# EAGLE design source_eagle (EAGLE 9.6.2)
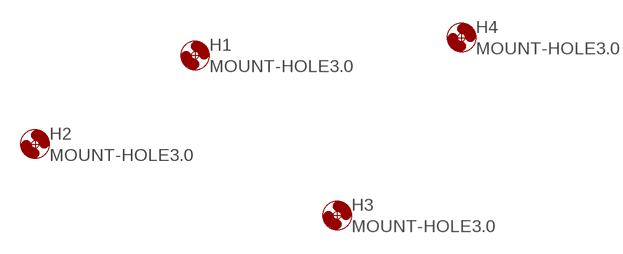
[diagram p0: schematic, sheet 1]

## Parts
H1  MOUNT-HOLE3.0  [3,0]
H2  MOUNT-HOLE3.0  [3,0]
H3  MOUNT-HOLE3.0  [3,0]
H4  MOUNT-HOLE3.0  [3,0]

## Library data of the parts
H1-H4 = holes:MOUNT-HOLE: MOUNTING HOLE with drill center marker

## Board
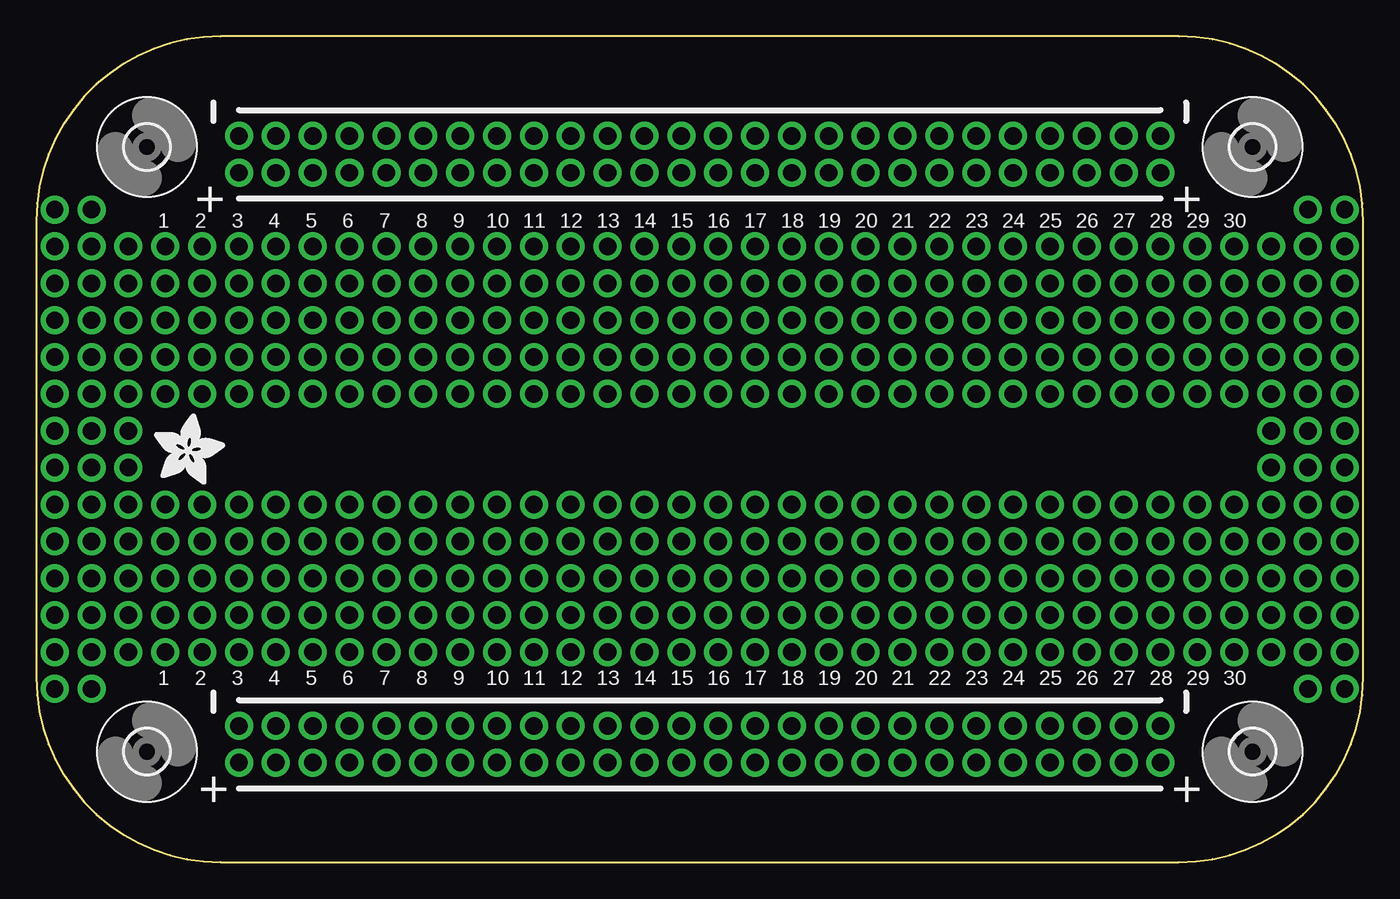
[diagram p1: board, top side]
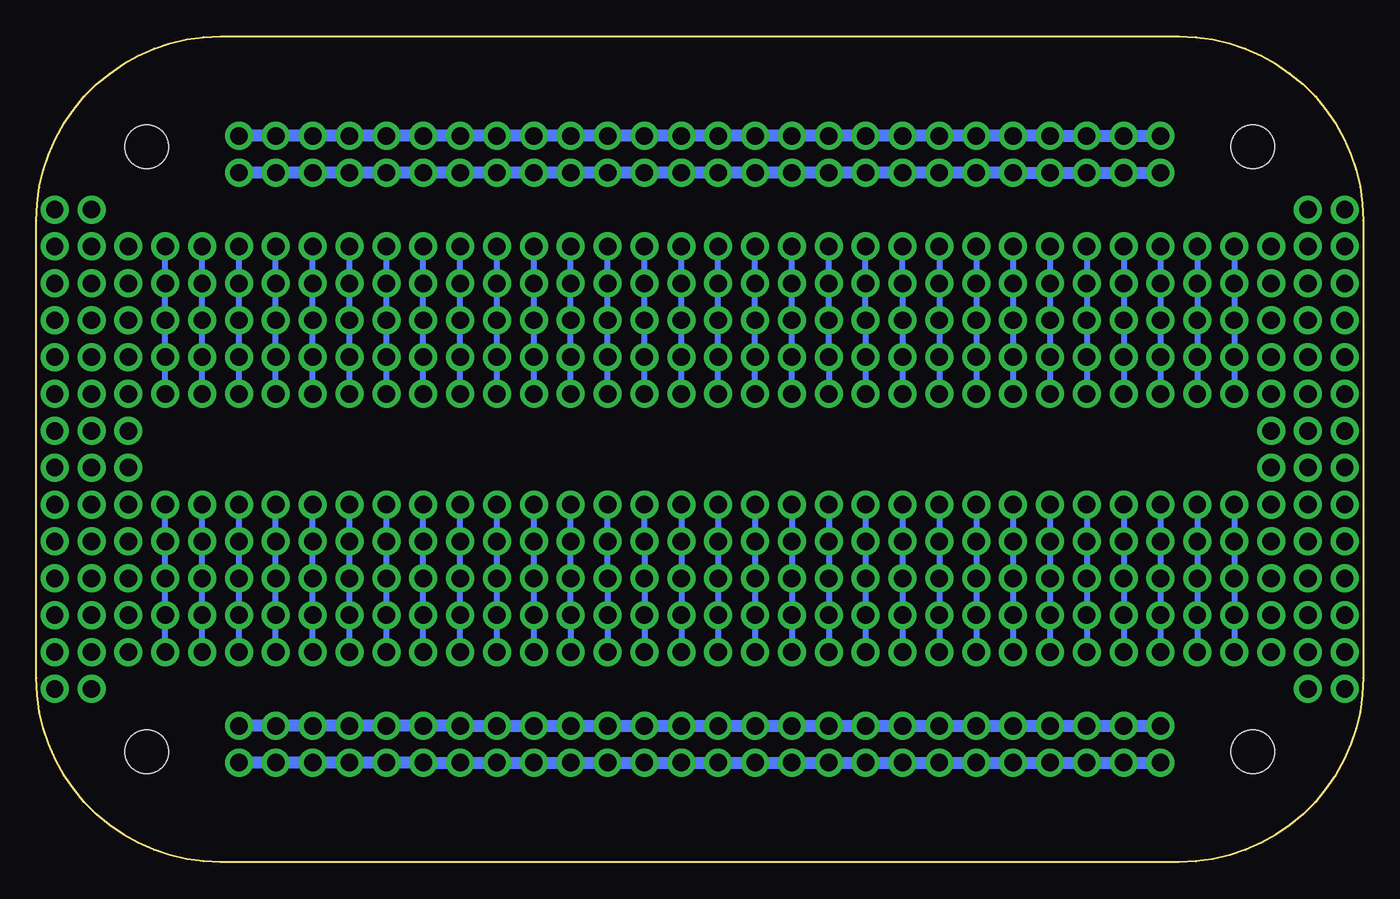
[diagram p2: board, bottom side, seen from below]

Size 91.44 x 56.9 mm. Coordinates in mm from the lower left corner, seen from the top.
Copper layers (1*16): Top 0.035mm / dielectric 1.5mm / Bottom 0.035mm
Design rules "default": minimum track width 10mil, minimum drill 24mil, track to track 8mil, track to pad 8mil, pad to pad 8mil, via to via 8mil, smd to smd 8mil, copper to edge 40mil, drill to drill 8mil, minimum pad ring 10mil, minimum via ring 8mil, stop-mask expansion 4mil, vias tented up to drill 0mil, thermal gap 10mil

### Footprints (pad centres in the part's own frame; a part is rotated, then mirrored left to right if it is on the bottom)
3,0 = hole 3: 0,0

### Placement (x,y rotation side)
H1  7.62,7.62 0 top
H2  83.82,7.62 0 top
H3  7.62,49.28 0 top
H4  83.82,49.28 0 top
U$2  [ALTOIDSTIN-DIM]  45.72,28.45 0 top
U$3  [ADAFRUIT_5MM]  8.13,26.04 0 top

### Tracks (layer width: path | path; a pad name or v marks a point on that pad's centre or on a via)
N$1  (via drill 1.2 pad 1.93)
  Bottom 0.406: v8.89,24.64 v8.89,22.1 v8.89,19.56 v8.89,17.02 v8.89,14.48
N$2  (via drill 1.2 pad 1.93)
  Bottom 0.406: v11.43,14.48 v11.43,17.02 v11.43,19.56 v11.43,22.1 v11.43,24.64
N$3  (via drill 1.2 pad 1.93)
  Bottom 0.406: v13.97,24.64 v13.97,22.1 v13.97,19.56 v13.97,17.02 v13.97,14.48
N$4  (via drill 1.2 pad 1.93)
  Bottom 0.406: v16.51,14.48 v16.51,17.02 v16.51,19.56 v16.51,22.1 v16.51,24.64
N$5  (via drill 1.2 pad 1.93)
  Bottom 0.406: v19.05,24.64 v19.05,22.1 v19.05,19.56 v19.05,17.02 v19.05,14.48
N$6  (via drill 1.2 pad 1.93)
  Bottom 0.406: v21.59,14.48 v21.59,17.02 v21.59,19.56 v21.59,22.1 v21.59,24.64
N$7  (via drill 1.2 pad 1.93)
  Bottom 0.406: v26.67,14.48 v26.67,17.02 v26.67,19.56 v26.67,22.1 v26.67,24.64
N$8  (via drill 1.2 pad 1.93)
  Bottom 0.406: v24.13,24.64 v24.13,22.1 v24.13,19.56 v24.13,17.02 v24.13,14.48
N$9  (via drill 1.2 pad 1.93)
  Bottom 0.406: v29.21,24.64 v29.21,22.1 v29.21,19.56 v29.21,17.02 v29.21,14.48
N$10  (via drill 1.2 pad 1.93)
  Bottom 0.406: v31.75,24.64 v31.75,22.1 v31.75,19.56 v31.75,17.02 v31.75,14.48
N$11  (via drill 1.2 pad 1.93)
  Bottom 0.406: v34.29,24.64 v34.29,22.1 v34.29,19.56 v34.29,17.02 v34.29,14.48
N$12  (via drill 1.2 pad 1.93)
  Bottom 0.406: v36.83,14.48 v36.83,17.02 v36.83,19.56 v36.83,22.1 v36.83,24.64
N$13  (via drill 1.2 pad 1.93)
  Bottom 0.406: v39.37,24.64 v39.37,22.1 v39.37,19.56 v39.37,17.02 v39.37,14.48
N$14  (via drill 1.2 pad 1.93)
  Bottom 0.406: v41.91,14.48 v41.91,17.02 v41.91,19.56 v41.91,22.1 v41.91,24.64
N$15  (via drill 1.2 pad 1.93)
  Bottom 0.406: v44.45,14.48 v44.45,17.02 v44.45,19.56 | v44.45,22.1 v44.45,19.56 | v44.45,24.64 v44.45,22.1 | v44.45,22.1 v44.45,19.56
N$16  (via drill 1.2 pad 1.93)
  Bottom 0.406: v46.99,24.64 v46.99,22.1 v46.99,19.56 v46.99,17.02 v46.99,14.48
N$17  (via drill 1.2 pad 1.93)
  Bottom 0.406: v52.07,24.64 v52.07,22.1 v52.07,19.56 v52.07,17.02 v52.07,14.48
N$18  (via drill 1.2 pad 1.93)
  Bottom 0.406: v49.53,14.48 v49.53,17.02 v49.53,19.56 v49.53,22.1 v49.53,24.64
N$19  (via drill 1.2 pad 1.93)
  Bottom 0.406: v54.61,24.64 v54.61,22.1 v54.61,19.56 v54.61,17.02 v54.61,14.48
N$20  (via drill 1.2 pad 1.93)
  Bottom 0.406: v57.15,14.48 v57.15,17.02 v57.15,19.56 v57.15,22.1 v57.15,24.64
N$21  (via drill 1.2 pad 1.93)
  Bottom 0.406: v62.23,14.48 v62.23,17.02 v62.23,19.56 v62.23,22.1 v62.23,24.64
N$22  (via drill 1.2 pad 1.93)
  Bottom 0.406: v59.69,24.64 v59.69,22.1 v59.69,19.56 v59.69,17.02 v59.69,14.48
N$23  (via drill 1.2 pad 1.93)
  Bottom 0.406: v64.77,24.64 v64.77,22.1 v64.77,19.56 v64.77,17.02 v64.77,14.48
N$24  (via drill 1.2 pad 1.93)
  Bottom 0.406: v67.31,14.48 v67.31,17.02 v67.31,19.56 v67.31,22.1 v67.31,24.64
N$25  (via drill 1.2 pad 1.93)
  Bottom 0.406: v69.85,24.64 v69.85,22.1 v69.85,19.56 v69.85,17.02 v69.85,14.48
N$26  (via drill 1.2 pad 1.93)
  Bottom 0.406: v72.39,14.48 v72.39,17.02 v72.39,19.56 v72.39,22.1 v72.39,24.64
N$27  (via drill 1.2 pad 1.93)
  Bottom 0.406: v77.47,24.64 v77.47,22.1 v77.47,19.56 v77.47,17.02 v77.47,14.48
N$28  (via drill 1.2 pad 1.93)
  Bottom 0.406: v74.93,14.48 v74.93,17.02 v74.93,19.56 v74.93,22.1 v74.93,24.64
N$29  (via drill 1.2 pad 1.93)
  Bottom 0.406: v80.01,24.64 v80.01,22.1 v80.01,19.56 v80.01,17.02 v80.01,14.48
N$30  (via drill 1.2 pad 1.93)
  Bottom 0.406: v82.55,14.48 v82.55,17.02 v82.55,19.56 v82.55,22.1 v82.55,24.64
N$31  (via drill 1.2 pad 1.93)
  Bottom 0.813: v13.97,9.4 v16.51,9.4 v19.05,9.4 v21.59,9.4 v24.13,9.4 v26.67,9.4 v29.21,9.4 v31.75,9.4 v34.29,9.4 v36.83,9.4 v39.37,9.4 v41.91,9.4 v44.45,9.4 v46.99,9.4 v49.53,9.4 v52.07,9.4 v54.61,9.4 | v74.93,9.4 v77.47,9.4 | v72.39,9.4 v74.93,9.4 | v72.39,9.4 v74.93,9.4 | v57.15,9.4 v54.61,9.4 | v57.15,9.4 v54.61,9.4 | v57.15,9.4 v59.69,9.4 v62.23,9.4 v64.77,9.4 v67.31,9.4 v69.85,9.4 v72.39,9.4
N$32  (via drill 1.2 pad 1.93)
  Bottom 0.813: v13.97,6.86 v16.51,6.86 v19.05,6.86 v21.59,6.86 v24.13,6.86 v26.67,6.86 v29.21,6.86 v31.75,6.86 v34.29,6.86 v36.83,6.86 v39.37,6.86 v41.91,6.86 v44.45,6.86 v46.99,6.86 v49.53,6.86 v52.07,6.86 v54.61,6.86 | v57.15,6.86 v54.61,6.86 | v57.15,6.86 v54.61,6.86 | v57.15,6.86 v59.69,6.86 v62.23,6.86 v64.77,6.86 v67.31,6.86 v69.85,6.86 v72.39,6.86 | v74.93,6.86 v77.47,6.86 | v72.39,6.86 v74.93,6.86 | v72.39,6.86 v74.93,6.86
N$33  (via drill 1.2 pad 1.93)
  Bottom 0.406: v82.55,32.26 v82.55,34.8 v82.55,37.34 v82.55,39.88 v82.55,42.42
N$34  (via drill 1.2 pad 1.93)
  Bottom 0.406: v80.01,42.42 v80.01,39.88 v80.01,37.34 v80.01,34.8 v80.01,32.26
N$35  (via drill 1.2 pad 1.93)
  Bottom 0.406: v77.47,32.26 v77.47,34.8 v77.47,37.34 v77.47,39.88 v77.47,42.42
N$36  (via drill 1.2 pad 1.93)
  Bottom 0.406: v74.93,42.42 v74.93,39.88 v74.93,37.34 v74.93,34.8 v74.93,32.26
N$37  (via drill 1.2 pad 1.93)
  Bottom 0.406: v72.39,32.26 v72.39,34.8 v72.39,37.34 v72.39,39.88 v72.39,42.42
N$38  (via drill 1.2 pad 1.93)
  Bottom 0.406: v69.85,42.42 v69.85,39.88 v69.85,37.34 v69.85,34.8 v69.85,32.26
N$39  (via drill 1.2 pad 1.93)
  Bottom 0.406: v64.77,42.42 v64.77,39.88 v64.77,37.34 v64.77,34.8 v64.77,32.26
N$40  (via drill 1.2 pad 1.93)
  Bottom 0.406: v67.31,32.26 v67.31,34.8 v67.31,37.34 v67.31,39.88 v67.31,42.42
N$41  (via drill 1.2 pad 1.93)
  Bottom 0.406: v62.23,32.26 v62.23,34.8 v62.23,37.34 v62.23,39.88 v62.23,42.42
N$42  (via drill 1.2 pad 1.93)
  Bottom 0.406: v59.69,32.26 v59.69,34.8 v59.69,37.34 v59.69,39.88 v59.69,42.42
N$43  (via drill 1.2 pad 1.93)
  Bottom 0.406: v57.15,32.26 v57.15,34.8 v57.15,37.34 v57.15,39.88 v57.15,42.42
N$44  (via drill 1.2 pad 1.93)
  Bottom 0.406: v54.61,42.42 v54.61,39.88 v54.61,37.34 v54.61,34.8 v54.61,32.26
N$45  (via drill 1.2 pad 1.93)
  Bottom 0.406: v52.07,32.26 v52.07,34.8 v52.07,37.34 v52.07,39.88 v52.07,42.42
N$46  (via drill 1.2 pad 1.93)
  Bottom 0.406: v49.53,42.42 v49.53,39.88 v49.53,37.34 v49.53,34.8 v49.53,32.26
N$47  (via drill 1.2 pad 1.93)
  Bottom 0.406: v46.99,42.42 v46.99,39.88 v46.99,37.34 | v46.99,34.8 v46.99,37.34 | v46.99,32.26 v46.99,34.8 | v46.99,34.8 v46.99,37.34
N$48  (via drill 1.2 pad 1.93)
  Bottom 0.406: v44.45,32.26 v44.45,34.8 v44.45,37.34 v44.45,39.88 v44.45,42.42
N$49  (via drill 1.2 pad 1.93)
  Bottom 0.406: v39.37,32.26 v39.37,34.8 v39.37,37.34 v39.37,39.88 v39.37,42.42
N$50  (via drill 1.2 pad 1.93)
  Bottom 0.406: v41.91,42.42 v41.91,39.88 v41.91,37.34 v41.91,34.8 v41.91,32.26
N$51  (via drill 1.2 pad 1.93)
  Bottom 0.406: v36.83,32.26 v36.83,34.8 v36.83,37.34 v36.83,39.88 v36.83,42.42
N$52  (via drill 1.2 pad 1.93)
  Bottom 0.406: v34.29,42.42 v34.29,39.88 v34.29,37.34 v34.29,34.8 v34.29,32.26
N$53  (via drill 1.2 pad 1.93)
  Bottom 0.406: v29.21,42.42 v29.21,39.88 v29.21,37.34 v29.21,34.8 v29.21,32.26
N$54  (via drill 1.2 pad 1.93)
  Bottom 0.406: v31.75,32.26 v31.75,34.8 v31.75,37.34 v31.75,39.88 v31.75,42.42
N$55  (via drill 1.2 pad 1.93)
  Bottom 0.406: v26.67,32.26 v26.67,34.8 v26.67,37.34 v26.67,39.88 v26.67,42.42
N$56  (via drill 1.2 pad 1.93)
  Bottom 0.406: v24.13,42.42 v24.13,39.88 v24.13,37.34 v24.13,34.8 v24.13,32.26
N$57  (via drill 1.2 pad 1.93)
  Bottom 0.406: v21.59,32.26 v21.59,34.8 v21.59,37.34 v21.59,39.88 v21.59,42.42
N$58  (via drill 1.2 pad 1.93)
  Bottom 0.406: v19.05,42.42 v19.05,39.88 v19.05,37.34 v19.05,34.8 v19.05,32.26
N$59  (via drill 1.2 pad 1.93)
  Bottom 0.406: v13.97,32.26 v13.97,34.8 v13.97,37.34 v13.97,39.88 v13.97,42.42
N$60  (via drill 1.2 pad 1.93)
  Bottom 0.406: v16.51,42.42 v16.51,39.88 v16.51,37.34 v16.51,34.8 v16.51,32.26
N$61  (via drill 1.2 pad 1.93)
  Bottom 0.406: v11.43,32.26 v11.43,34.8 v11.43,37.34 v11.43,39.88 v11.43,42.42
N$62  (via drill 1.2 pad 1.93)
  Bottom 0.406: v8.89,42.42 v8.89,39.88 v8.89,37.34 v8.89,34.8 v8.89,32.26
N$63  (via drill 1.2 pad 1.93)
  Bottom 0.813: v77.47,47.5 v74.93,47.5 v72.39,47.5 v69.85,47.5 v67.31,47.5 v64.77,47.5 v62.23,47.5 v59.69,47.5 v57.15,47.5 v54.61,47.5 v52.07,47.5 v49.53,47.5 v46.99,47.5 v44.45,47.5 v41.91,47.5 v39.37,47.5 v36.83,47.5 | v16.51,47.5 v13.97,47.5 | v19.05,47.5 v16.51,47.5 | v19.05,47.5 v16.51,47.5 | v34.29,47.5 v36.83,47.5 | v34.29,47.5 v36.83,47.5 | v34.29,47.5 v31.75,47.5 v29.21,47.5 v26.67,47.5 v24.13,47.5 v21.59,47.5 v19.05,47.5
N$64  (via drill 1.2 pad 1.93)
  Bottom 0.813: v77.47,50.04 v74.93,50.04 v72.39,50.04 v69.85,50.04 v67.31,50.04 v64.77,50.04 v62.23,50.04 v59.69,50.04 v57.15,50.04 v54.61,50.04 v52.07,50.04 v49.53,50.04 v46.99,50.04 v44.45,50.04 v41.91,50.04 v39.37,50.04 v36.83,50.04 | v34.29,50.04 v36.83,50.04 | v34.29,50.04 v36.83,50.04 | v34.29,50.04 v31.75,50.04 v29.21,50.04 v26.67,50.04 v24.13,50.04 v21.59,50.04 v19.05,50.04 | v16.51,50.04 v13.97,50.04 | v19.05,50.04 v16.51,50.04 | v19.05,50.04 v16.51,50.04
N$65  (via drill 1.2 pad 1.93)
  other vias: 6.35,42.42
N$66  (via drill 1.2 pad 1.93)
  other vias: 6.35,39.88
N$67  (via drill 1.2 pad 1.93)
  other vias: 6.35,37.34
N$68  (via drill 1.2 pad 1.93)
  other vias: 6.35,34.8
N$69  (via drill 1.2 pad 1.93)
  other vias: 6.35,32.26
N$70  (via drill 1.2 pad 1.93)
  other vias: 3.81,32.26
N$71  (via drill 1.2 pad 1.93)
  other vias: 3.81,34.8
N$72  (via drill 1.2 pad 1.93)
  other vias: 3.81,37.34
N$73  (via drill 1.2 pad 1.93)
  other vias: 3.81,39.88
N$74  (via drill 1.2 pad 1.93)
  other vias: 3.81,42.42
N$75  (via drill 1.2 pad 1.93)
  other vias: 3.81,44.96
N$76  (via drill 1.2 pad 1.93)
  other vias: 1.27,44.96
N$77  (via drill 1.2 pad 1.93)
  other vias: 1.27,42.42
N$78  (via drill 1.2 pad 1.93)
  other vias: 1.27,39.88
N$79  (via drill 1.2 pad 1.93)
  other vias: 1.27,37.34
N$80  (via drill 1.2 pad 1.93)
  other vias: 1.27,34.8
N$81  (via drill 1.2 pad 1.93)
  other vias: 1.27,32.26
N$82  (via drill 1.2 pad 1.93)
  other vias: 1.27,29.72
N$83  (via drill 1.2 pad 1.93)
  other vias: 3.81,29.72
N$84  (via drill 1.2 pad 1.93)
  other vias: 3.81,27.18
N$85  (via drill 1.2 pad 1.93)
  other vias: 1.27,27.18
N$86  (via drill 1.2 pad 1.93)
  other vias: 1.27,22.1
N$87  (via drill 1.2 pad 1.93)
  other vias: 3.81,24.64
N$88  (via drill 1.2 pad 1.93)
  other vias: 3.81,22.1
N$89  (via drill 1.2 pad 1.93)
  other vias: 1.27,24.64
N$90  (via drill 1.2 pad 1.93)
  other vias: 6.35,29.72
N$91  (via drill 1.2 pad 1.93)
  other vias: 6.35,27.18
N$92  (via drill 1.2 pad 1.93)
  other vias: 6.35,24.64
N$93  (via drill 1.2 pad 1.93)
  other vias: 6.35,22.1
N$94  (via drill 1.2 pad 1.93)
  other vias: 6.35,19.56
N$95  (via drill 1.2 pad 1.93)
  other vias: 6.35,17.02
N$96  (via drill 1.2 pad 1.93)
  other vias: 6.35,14.48
N$97  (via drill 1.2 pad 1.93)
  other vias: 3.81,14.48
N$98  (via drill 1.2 pad 1.93)
  other vias: 3.81,17.02
N$99  (via drill 1.2 pad 1.93)
  other vias: 3.81,19.56
N$100  (via drill 1.2 pad 1.93)
  other vias: 1.27,19.56
N$101  (via drill 1.2 pad 1.93)
  other vias: 1.27,17.02
N$102  (via drill 1.2 pad 1.93)
  other vias: 1.27,14.48
N$103  (via drill 1.2 pad 1.93)
  other vias: 3.81,11.94
N$104  (via drill 1.2 pad 1.93)
  other vias: 1.27,11.94
N$105  (via drill 1.2 pad 1.93)
  other vias: 85.09,42.42
N$106  (via drill 1.2 pad 1.93)
  other vias: 85.09,39.88
N$107  (via drill 1.2 pad 1.93)
  other vias: 85.09,37.34
N$108  (via drill 1.2 pad 1.93)
  other vias: 85.09,34.8
N$109  (via drill 1.2 pad 1.93)
  other vias: 85.09,32.26
N$110  (via drill 1.2 pad 1.93)
  other vias: 85.09,27.18
N$111  (via drill 1.2 pad 1.93)
  other vias: 85.09,22.1
N$112  (via drill 1.2 pad 1.93)
  other vias: 85.09,19.56
N$113  (via drill 1.2 pad 1.93)
  other vias: 85.09,17.02
N$114  (via drill 1.2 pad 1.93)
  other vias: 85.09,14.48
N$115  (via drill 1.2 pad 1.93)
  other vias: 87.63,11.94
N$116  (via drill 1.2 pad 1.93)
  other vias: 87.63,14.48
N$117  (via drill 1.2 pad 1.93)
  other vias: 87.63,17.02
N$118  (via drill 1.2 pad 1.93)
  other vias: 90.17,19.56
N$119  (via drill 1.2 pad 1.93)
  other vias: 87.63,19.56
N$120  (via drill 1.2 pad 1.93)
  other vias: 87.63,22.1
N$121  (via drill 1.2 pad 1.93)
  other vias: 90.17,22.1
N$122  (via drill 1.2 pad 1.93)
  other vias: 90.17,27.18
N$123  (via drill 1.2 pad 1.93)
  other vias: 87.63,24.64
N$124  (via drill 1.2 pad 1.93)
  other vias: 85.09,29.72
N$125  (via drill 1.2 pad 1.93)
  other vias: 85.09,24.64
N$126  (via drill 1.2 pad 1.93)
  other vias: 87.63,27.18
N$127  (via drill 1.2 pad 1.93)
  other vias: 90.17,24.64
N$128  (via drill 1.2 pad 1.93)
  other vias: 90.17,29.72
N$129  (via drill 1.2 pad 1.93)
  other vias: 87.63,29.72
N$130  (via drill 1.2 pad 1.93)
  other vias: 87.63,32.26
N$131  (via drill 1.2 pad 1.93)
  other vias: 90.17,32.26
N$132  (via drill 1.2 pad 1.93)
  other vias: 90.17,34.8
N$133  (via drill 1.2 pad 1.93)
  other vias: 87.63,34.8
N$134  (via drill 1.2 pad 1.93)
  other vias: 87.63,37.34
N$135  (via drill 1.2 pad 1.93)
  other vias: 90.17,37.34
N$136  (via drill 1.2 pad 1.93)
  other vias: 90.17,39.88
N$137  (via drill 1.2 pad 1.93)
  other vias: 87.63,39.88
N$138  (via drill 1.2 pad 1.93)
  other vias: 87.63,42.42
N$139  (via drill 1.2 pad 1.93)
  other vias: 90.17,42.42
N$140  (via drill 1.2 pad 1.93)
  other vias: 90.17,44.96
N$141  (via drill 1.2 pad 1.93)
  other vias: 87.63,44.96
N$142  (via drill 1.2 pad 1.93)
  other vias: 90.17,17.02
N$143  (via drill 1.2 pad 1.93)
  other vias: 90.17,14.48
N$144  (via drill 1.2 pad 1.93)
  other vias: 90.17,11.94

### Text on the board
tPlace: 1 | 2 | 3 | 4 | 5 | 6 | 7 | 8 | 9 | 10 | 11 | 12 | 13 | 14 | 15 | 16 | 17 | 18 | 19 | 20 | 21 | 22 | 23 | 24 | 25 | 26 | 27 | 28 | 29 | 30 | 1 | 2 | 3 | 4 | 5 | 6 | 7 | 8 | 9 | 10 | 11 | 12 | 13 | 14 | 15 | 16 | 17 | 18 | 19 | 20 | 21 | 22 | 23 | 24 | 25 | 26 | 27 | 28 | 29 | 30
tDocu: Adafruit Mint Tin-Sized PermaProto Breadboard
tPlaceRed: + | + | + | +